# Altium schematic sheet top.SchDoc
size 381 x 241 mm; SheetNumber: 4; SheetTotal: 8
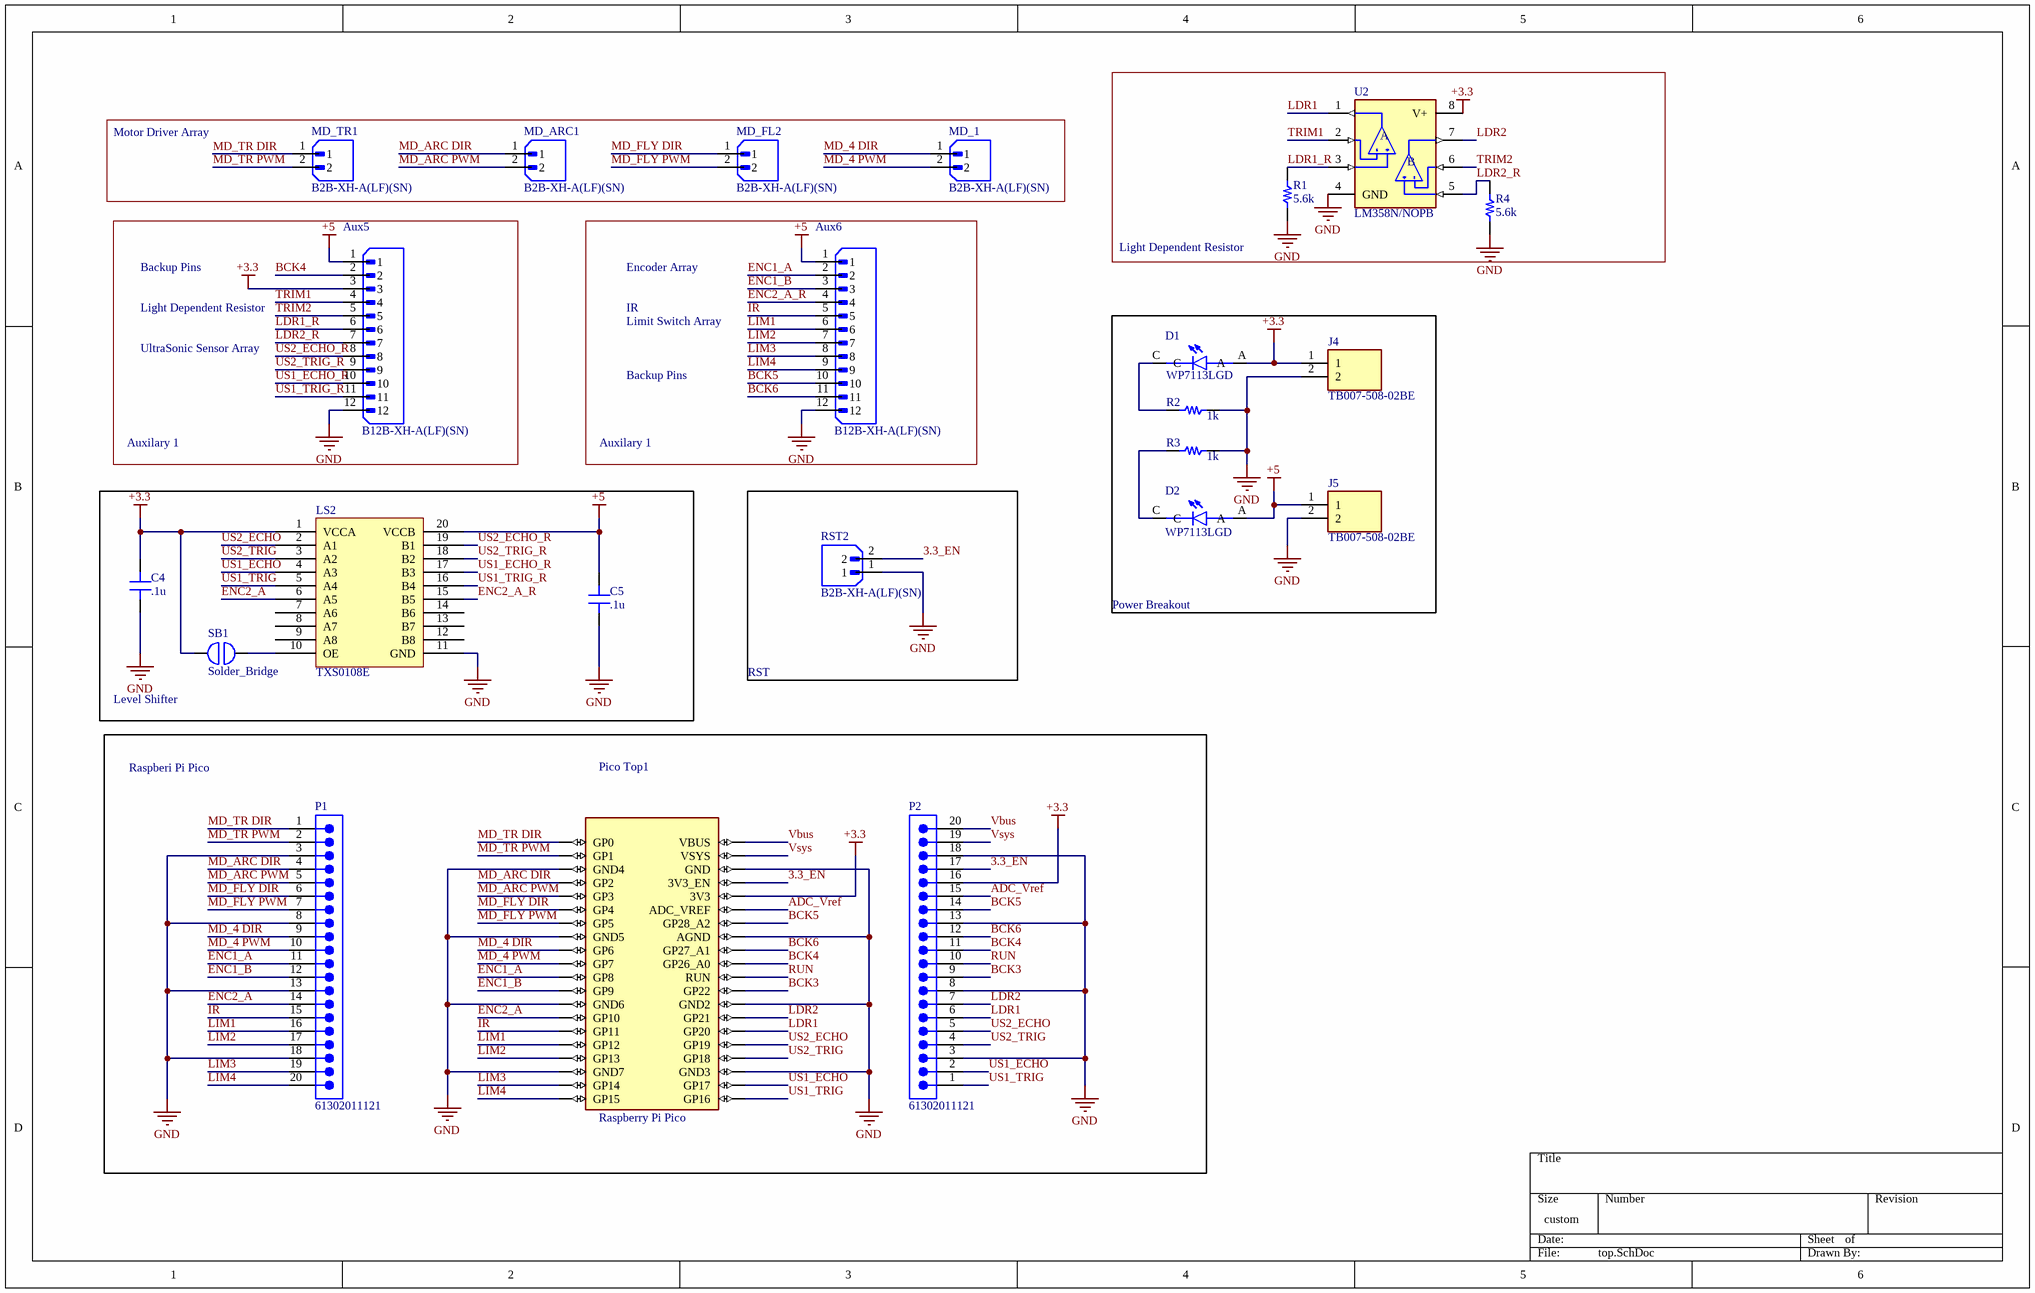
[diagram p0: top.SchDoc]

## Parts
Aux5  B12B-XH-A(LF)(SN)  [JST_B12B-XH-A(LF)(SN)]
Aux6  B12B-XH-A(LF)(SN)  [JST_B12B-XH-A(LF)(SN)]
C4  .1u  [generic_cap]
C5  .1u  [generic_cap]
D1  WP7113LGD  [LED_WP7113LGD]
D2  WP7113LGD  [LED_WP7113LGD]
J4  TB007-508-02BE  [CUI_TB007-508-02BE]
J5  TB007-508-02BE  [CUI_TB007-508-02BE]
LS2  TXS0108E  [TXS0108E footprint]
MD_1  B2B-XH-A(LF)(SN)  [JST_B2B-XH-A(LF)(SN)]
MD_ARC1  B2B-XH-A(LF)(SN)  [JST_B2B-XH-A(LF)(SN)]
MD_FL2  B2B-XH-A(LF)(SN)  [JST_B2B-XH-A(LF)(SN)]
MD_TR1  B2B-XH-A(LF)(SN)  [JST_B2B-XH-A(LF)(SN)]
P1  61302011121  [61302011121]
P2  61302011121  [61302011121]
Pico_Top1  Raspberry Pi Pico  [RASPBERRY_PI_PICO]
R1  5.6k  [generic_res_footprint]
R2  1k  [generic_res_footprint]
R3  1k  [generic_res_footprint]
R4  5.6k  [generic_res_footprint]
RST2  B2B-XH-A(LF)(SN)  [JST_B2B-XH-A(LF)(SN)]
SB1  Solder_Bridge  [Solder_Bridge-Footprint-1]
U2  LM358N/NOPB  [DIP794W45P254L959H508Q8]

## Blocks framed on the sheet
Motor Driver Array: MD_1 MD_ARC1 MD_FL2 MD_TR1
Light Dependent Resistor: R1 R4 U2
Power Breakout: D1 D2 J4 J5 R2 R3
Level Shifter: C4 C5 LS2 SB1
RST: RST2
Raspberi Pi Pico: P1 P2 Pico_Top1

## Nets
+3.3: Aux5.3 C4.2 D1.A J4.1 LS2.1(VCCA) P2.16 Pico_Top1.3V3 SB1.1 U2.8(V+)
+5: Aux5.1 Aux6.1 C5.2 D2.A J5.1 LS2.20(VCCB)
GND: Aux5.12 Aux6.12 C4.1 C5.1 J4.2 J5.2 LS2.11(GND) P1.3 P1.8 P1.13 P1.18 P2.3 P2.8 P2.13 P2.18 Pico_Top1.AGND Pico_Top1.GND Pico_Top1.GND2 Pico_Top1.GND3 Pico_Top1.GND4 Pico_Top1.GND5 Pico_Top1.GND6 Pico_Top1.GND7 R1.1 R2.2 R3.2 R4.1 RST2.1 U2.4(GND)
3.3_EN: P2.17 Pico_Top1.3V3_EN RST2.2
ADC_Vref: P2.15 Pico_Top1.ADC_VREF
BCK3: P2.9 Pico_Top1.GP22
BCK4: Aux5.2 P2.11 Pico_Top1.GP26_A0
BCK5: Aux6.10 P2.14 Pico_Top1.GP28_A2
BCK6: Aux6.11 P2.12 Pico_Top1.GP27_A1
ENC1_A: Aux6.2 P1.11 Pico_Top1.GP8
ENC1_B: Aux6.3 P1.12 Pico_Top1.GP9
ENC2_A: LS2.6(A5) P1.14 Pico_Top1.GP10
ENC2_A_R: Aux6.4 LS2.15(B5)
IR: Aux6.5 P1.15 Pico_Top1.GP11
LDR1: P2.6 Pico_Top1.GP20 U2.1(OUTA)
LDR1_R: Aux5.6 R1.2 U2.3(+INA)
LDR2: P2.7 Pico_Top1.GP21 U2.7(OUTB)
LDR2_R: Aux5.7 R4.2 U2.5(+INB)
LIM1: Aux6.6 P1.16 Pico_Top1.GP12
LIM2: Aux6.7 P1.17 Pico_Top1.GP13
LIM3: Aux6.8 P1.19 Pico_Top1.GP14
LIM4: Aux6.9 P1.20 Pico_Top1.GP15
MD_4 DIR: MD_1.1 P1.9 Pico_Top1.GP6
MD_4 PWM: MD_1.2 P1.10 Pico_Top1.GP7
MD_ARC DIR: MD_ARC1.1 P1.4 Pico_Top1.GP2
MD_ARC PWM: MD_ARC1.2 P1.5 Pico_Top1.GP3
MD_FLY DIR: MD_FL2.1 P1.6 Pico_Top1.GP4
MD_FLY PWM: MD_FL2.2 P1.7 Pico_Top1.GP5
MD_TR DIR: MD_TR1.1 P1.1 Pico_Top1.GP0
MD_TR PWM: MD_TR1.2 P1.2 Pico_Top1.GP1
RUN: P2.10 Pico_Top1.RUN
TRIM1: Aux5.4 U2.2(-INA)
TRIM2: Aux5.5 U2.6(-INB)
US1_ECHO: LS2.4(A3) P2.2 Pico_Top1.GP17
US1_ECHO_R: Aux5.10 LS2.17(B3)
US1_TRIG: LS2.5(A4) P2.1 Pico_Top1.GP16
US1_TRIG_R: Aux5.11 LS2.16(B4)
US2_ECHO: LS2.2(A1) P2.5 Pico_Top1.GP19
US2_ECHO_R: Aux5.8 LS2.19(B1)
US2_TRIG: LS2.3(A2) P2.4 Pico_Top1.GP18
US2_TRIG_R: Aux5.9 LS2.18(B2)
Vbus: P2.20 Pico_Top1.VBUS
Vsys: P2.19 Pico_Top1.VSYS
NetD1_C: D1.C R2.1
NetD2_C: D2.C R3.1
NetLS2_10: LS2.10(OE) SB1.2

Not connected (* = marked no-connect by the designer): LS2 7(A6) 8(A7) 9(A8) 12(B8) 13(B7) 14(B6)

## Notes on the sheet
- Backup Pins
- Encoder Array
- UltraSonic Sensor Array
- Light Dependent Resistor
- Limit Switch Array
- IR
- Auxilary 1
- (in symbol CMP-416-000000-1) A; B

## Library data of the parts
Aux5 Aux6 = CMP-398-000513-1: Connector Header Through Hole 12 position 0.098 (2.50mm); MF: JST Sales; Package: None; SnapEDA_Link: https://www.snapeda.com/parts/B12B-XH-A(LF)(SN)/JST+Sales+America+Inc./view-part/?ref=snap; Source: B12B-XH-A(LF)(SN).SchLib; Check_prices: https://www.snapeda.com/parts/B12B-XH-A(LF)(SN)/JST+Sales+America+Inc./view-part/?ref=eda; Value: *; Design Item ID: B12B-XH-A(LF)(SN); MP: B12B-XH-A(LF)(SN); Pin Count: 12; Component Type: Standard
C4 C5 = CMP-396-000000-3: Generic Ceramic Capacitor; MP: RDER71H472K0K1H03B; Price: None; Package: None; Value: *; Source: RDER71H472K0K1H03B.SchLib; Design Item ID: RDER71H472K0K1H03B; Pin Count: 2; Component Type: Standard; Availability: Unavailable
D1 D2 = CMP-352-000000-1: Green 568nm LED Indication - Discrete 1.9V Radial; MF: Kingbright; Value: *; Component Type: Standard; Design Item ID: WP7113LGD; Package: Radial Kingbright; Price: None; Source: WP7113LGD.SchLib; SnapEDA_Link: https://www.snapeda.com/parts/WP7113LGD/Kingbright/view-part/?ref=snap; Check_prices: https://www.snapeda.com/parts/WP7113LGD/Kingbright/view-part/?ref=eda; Pin Count: 2; Availability: In Stock; Purchase-URL: https://pricing.snapeda.com/search/part/WP7113LGD/?ref=eda; MP: WP7113LGD
J4 J5 = CMP-390-000000-3: Barrier Strip Terminal Block; MF: {'manufacturer': u'CUI'}; Source: TB007-508-02BE.SchLib; Component Type: Standard; Design Item ID: TB007-508-02BE; Availability: Unavailable; Value: *; Price: None; Pin Count: 2; MP: TB007-508-02BE; Package: None
LS2 = CMP-00015-2: 8 Channel Logic Level Shifter module
MD_1 MD_ARC1 MD_FL2 MD_TR1 RST2 = CMP-332-000000-1: Connector Header Through Hole 2 position 0.098 (2.50mm); MF: JST Sales America Inc.; Component Type: Standard; Value: *; Check_prices: https://www.snapeda.com/parts/B2B-XH-A(LF)(SN)/JST+Sales+America+Inc./view-part/?ref=eda; Package: None; MP: B2B-XH-A(LF)(SN); SnapEDA_Link: https://www.snapeda.com/parts/B2B-XH-A(LF)(SN)/JST+Sales+America+Inc./view-part/?ref=snap; Pin Count: 2; Source: B2B-XH-A(LF)(SN).SchLib; Design Item ID: B2B-XH-A(LF)(SN)
P1 P2 = CMP-398-000243-1: WR-PHD Pin Header, THT, Vertical, pitch 2.54mm, 1 Row, 20P; Manufacturer: Wurth Elektronik; Withstanding Voltage: 500V; Working Voltage: 250V; Rated Current: 3A; Contact Resistance: 20mOhm; ComponentLink2URL: https://www.we-online.com/redexpert/spec/61302011121?ad; Packaging: Bag; Orientation: Vertical; Match Code: WR-PHD; Number of Pins: 20; Number of Rows: 1; Gender: Pin Header; Source: WR-PHD.SchLib; Design Item ID: 61302011121; ComponentLink1Description: Website Link; Operating Temperature Min: -40°C; Manufacturer Part Number: 61302011121; ComponentLink2Description: Datasheet Link; ComponentLink1URL: https://www.we-online.com/redexpert/article/61302011121?ad; Operating Temperature Max: 105°C; Component Type: Standard; Mount: Through Hole; Category: Board-to-Board Connectors; Pin Count: 20; Pitch: 2.54mm
Pico_Top1 = CMP-394-000000-2: Raspberry Pi Board, Arm Cortex-M0+; Component Type: Standard; MF: Raspberry Pi; Design Item ID: RASPBERRY_PI_PICO; MP: RASPBERRY PI PICO; SnapEDA_Link: https://www.snapeda.com/parts/RASPBERRY%20PI%20PICO/Raspberry+Pi/view-part/?ref=snap; Check_prices: https://www.snapeda.com/parts/RASPBERRY%20PI%20PICO/Raspberry+Pi/view-part/?ref=eda; Package: None; Source: RASPBERRY_PI_PICO.SchLib; Pin Count: 40; Value: *
R1-R4 = CMP-340-000000-2: Generic through hole resistor
SB1 = CMP-00024-5: Solder bridge component
U2 = CMP-416-000000-1: General Purpose Amplifier 2 Circuit - 8-PDIP; MP: LM358N; MF: ON Semiconductor; Pin Count: 8; Component Type: Standard; Check_prices: https://www.snapeda.com/parts/LM358N/Onsemi/view-part/?ref=eda; Package: PDIP-8 ON Semiconductor; Value: *; Source: LM358N_NOPB.SchLib; SnapEDA_Link: https://www.snapeda.com/parts/LM358N/Onsemi/view-part/?ref=snap; Design Item ID: LM358N/NOPB